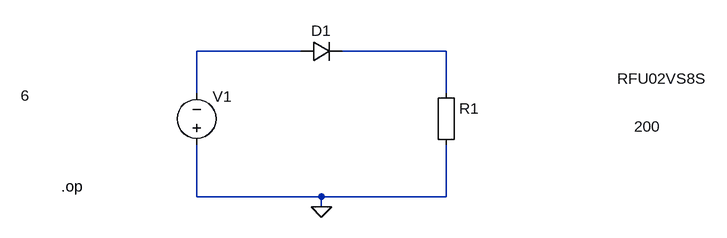
[diagram p0: schematic R-F-1.asc]
R-F-1.asc, the LTspice schematic file:
Version 4
SHEET 1 880 680
WIRE 16 128 -144 128
WIRE 240 128 80 128
WIRE -144 192 -144 128
WIRE 240 192 240 128
WIRE -144 352 -144 272
WIRE 48 352 -144 352
WIRE 240 352 240 272
WIRE 240 352 48 352
WIRE 48 368 48 352
FLAG 48 368 0
SYMBOL diode 16 144 R270
WINDOW 0 32 32 VTop 2
WINDOW 3 -10 556 VBottom 2
SYMATTR InstName D1
SYMATTR Value RFU02VS8S
SYMBOL Misc\\EuropeanResistor 224 176 R0
WINDOW 3 305 68 Left 2
SYMATTR InstName R1
SYMATTR Value 200
SYMBOL voltage -144 288 R180
WINDOW 3 257 92 Left 2
WINDOW 123 0 0 Left 2
WINDOW 39 0 0 Left 2
WINDOW 0 -54 90 Left 2
SYMATTR Value 6
SYMATTR InstName V1
TEXT -352 336 Left 2 !.op

The netlist it stands for:
* R-F-1.asc
D1 N001 N002 RFU02VS8S
R1 N002 0 200
V1 0 N001 6
.model D D
.lib standard.dio
.op
.backanno
.end